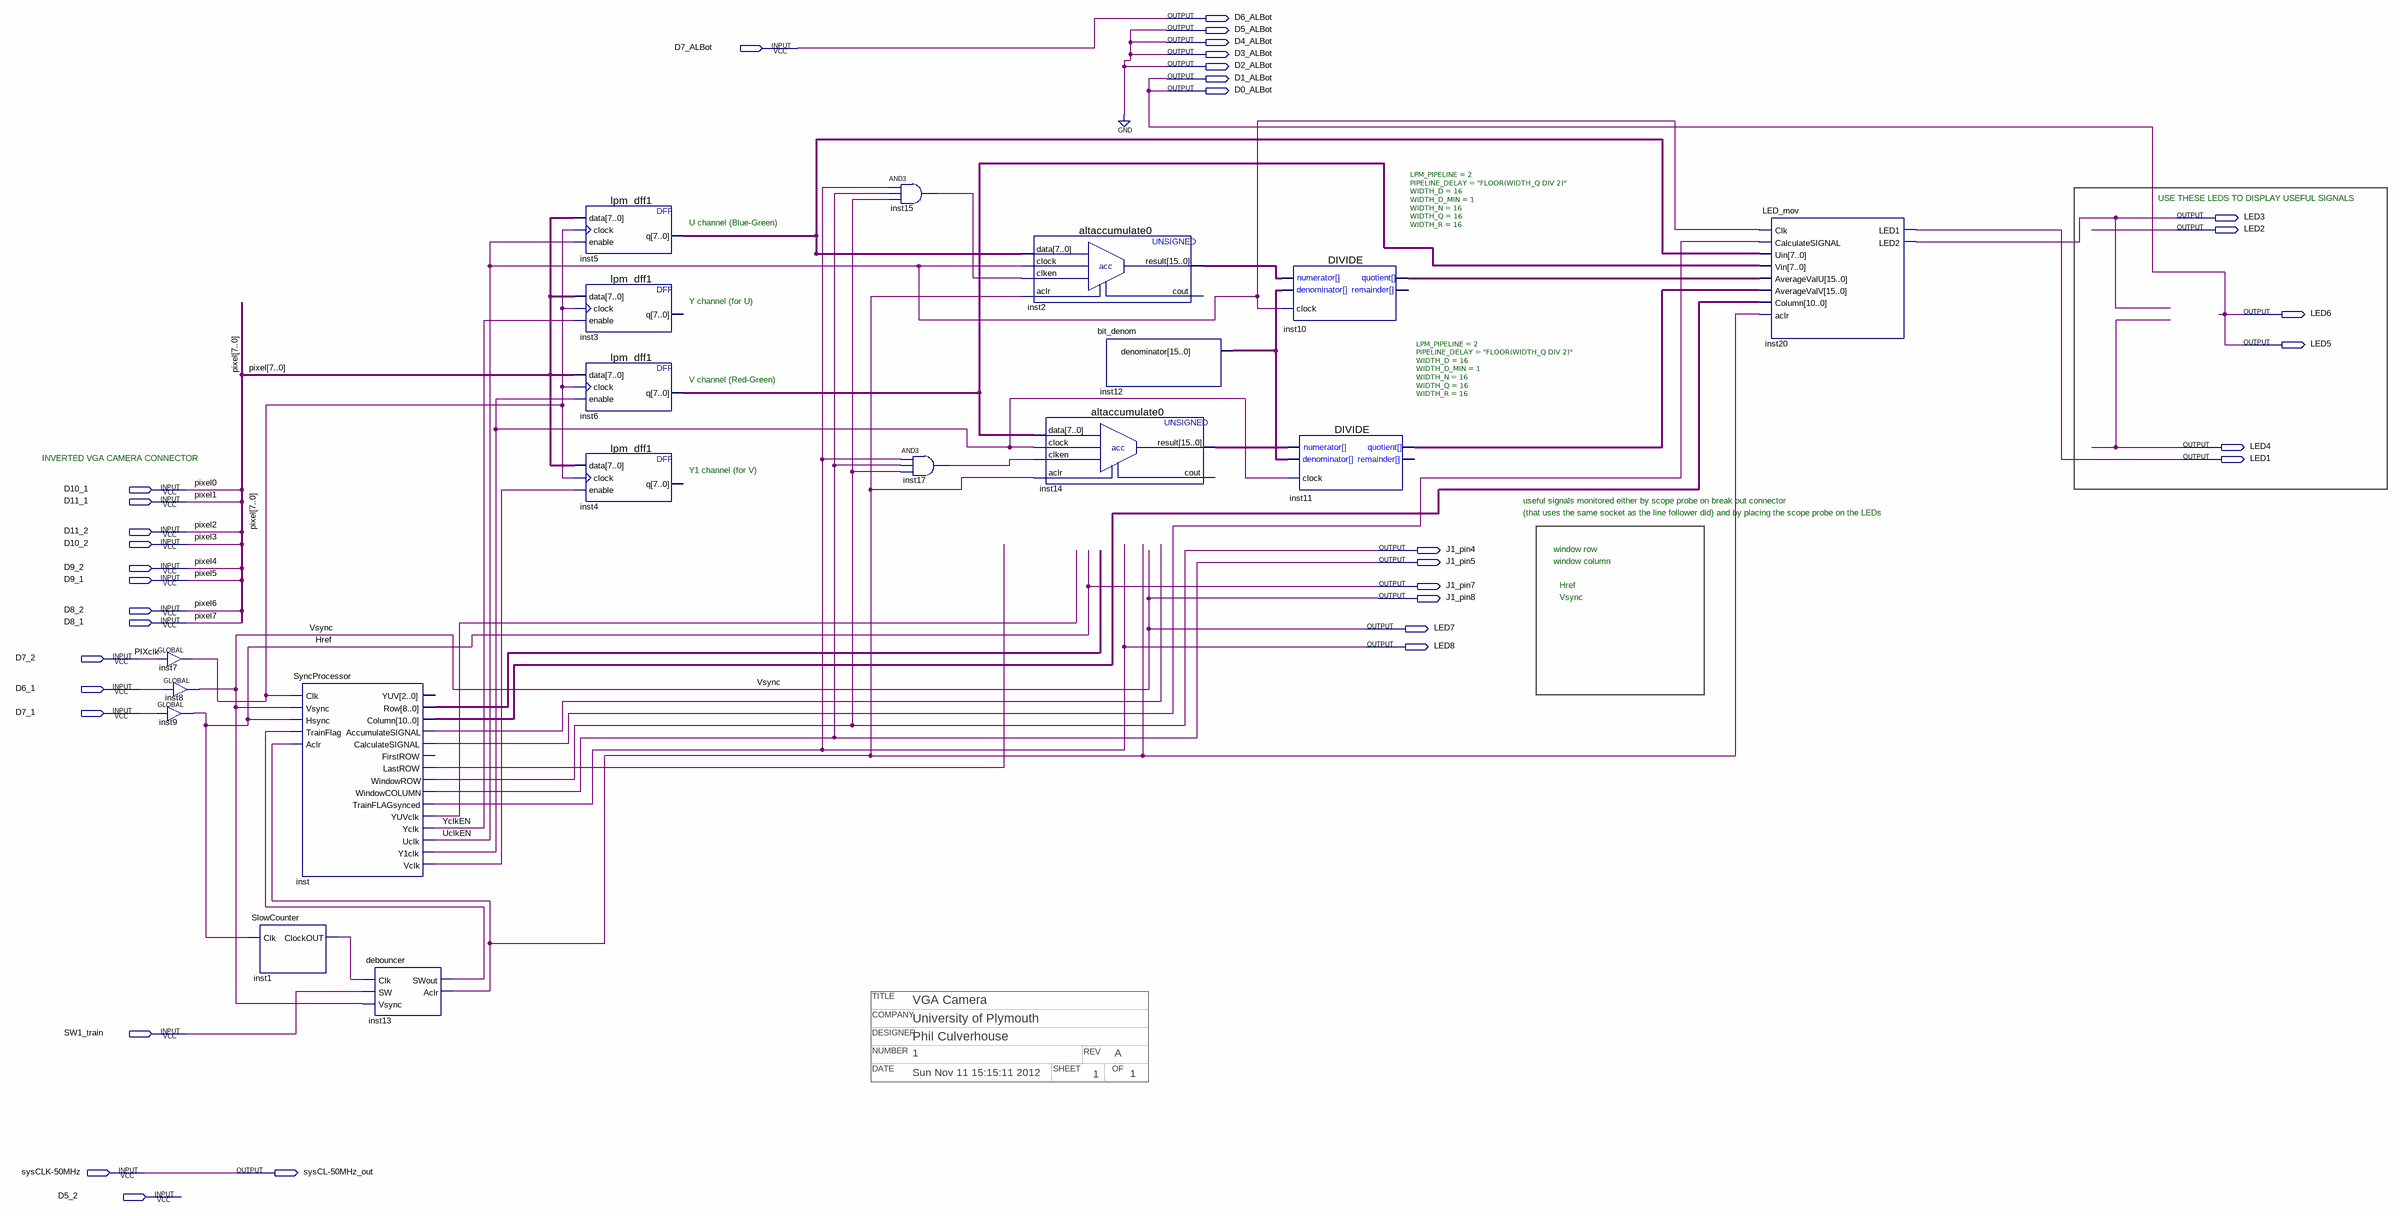
[diagram p0: schematic sheet]
// Quartus schematic VGA-Camera-2006.bdf as structural Verilog: 18 symbols, 35 pins
// Title block: TITLE: VGA Camera; COMPANY: University of Plymouth; DESIGNER: Phil Culverhouse; NUMBER: 1; REV: A; DATE: Sun Nov 11 15:15:11 2012; SHEET: 1; OF: 1
module \VGA-Camera-2006  (
  input  D7_ALBot,
  input  D10_1,
  input  D11_1,
  input  D11_2,
  input  D10_2,
  input  D9_2,
  input  D9_1,
  input  D8_2,
  input  D8_1,
  input  D7_2,
  input  D6_1,
  input  D7_1,
  input  SW1_train,
  input  \sysCLK-50MHz ,
  input  D5_2,
  output D6_ALBot,
  output D5_ALBot,
  output D4_ALBot,
  output D3_ALBot,
  output D2_ALBot,
  output D1_ALBot,
  output D0_ALBot,
  output LED3,
  output LED2,
  output LED6,
  output LED5,
  output LED4,
  output LED1,
  output J1_pin4,
  output J1_pin5,
  output J1_pin7,
  output J1_pin8,
  output LED7,
  output LED8,
  output \sysCL-50MHz_out 
);

  wire inst1_clockout, inst7_out, inst13_aclr, inst13_swout, inst15_out, inst17_out, inst_accumulatesignal,
       inst_calculatesignal, inst_lastrow, inst_vclk, inst_y1clk, inst_yuvclk, UclkEN, YclkEN;
  wire [7:0] inst5_q, inst6_q;
  wire [8:0] inst_row;
  wire [10:0] inst_column;
  wire [15:0] inst2_result, inst10_quotient, inst11_quotient, inst12_denominator, inst14_result;

  GLOBAL inst7 (.IN(D7_2), .OUT(inst7_out));
  GLOBAL inst8 (.IN(D6_1), .OUT(J1_pin8));
  GLOBAL inst9 (.IN(D7_1), .OUT(J1_pin7));
  SlowCounter inst1 (.Clk(J1_pin7), .ClockOUT(inst1_clockout));
  SyncProcessor inst (
    .Clk(inst7_out), .Vsync(J1_pin8), .Hsync(J1_pin7), .TrainFlag(inst13_swout), .Aclr(inst13_aclr),
    .Row(inst_row), .Column(inst_column), .AccumulateSIGNAL(inst_accumulatesignal),
    .CalculateSIGNAL(inst_calculatesignal), .LastROW(inst_lastrow), .WindowROW(J1_pin4),
    .WindowCOLUMN(J1_pin5), .TrainFLAGsynced(LED8), .YUVclk(inst_yuvclk), .Yclk(YclkEN), .Uclk(UclkEN),
    .Y1clk(inst_y1clk), .Vclk(inst_vclk));  // open: YUV, FirstROW
  debouncer inst13 (.Clk(inst1_clockout), .SW(SW1_train), .Vsync(J1_pin8), .SWout(inst13_swout), .Aclr(inst13_aclr));
  lpm_dff1 inst5 (
    .data({D8_1, D8_2, D9_1, D9_2, D10_2, D11_2, D11_1, D10_1}), .clock(inst7_out), .enable(UclkEN),
    .q(inst5_q));
  lpm_dff1 inst3 (
    .data({D8_1, D8_2, D9_1, D9_2, D10_2, D11_2, D11_1, D10_1}), .clock(inst7_out), .enable(YclkEN));  // open: q
  lpm_dff1 inst6 (
    .data({D8_1, D8_2, D9_1, D9_2, D10_2, D11_2, D11_1, D10_1}), .clock(inst7_out), .enable(inst_y1clk),
    .q(inst6_q));
  lpm_dff1 inst4 (
    .data({D8_1, D8_2, D9_1, D9_2, D10_2, D11_2, D11_1, D10_1}), .clock(inst7_out), .enable(inst_vclk));  // open: q
  and inst15 (inst15_out, LED8, J1_pin5, J1_pin4);
  and inst17 (inst17_out, LED8, J1_pin5, J1_pin4);
  altaccumulate0 inst2 (
    .data(inst5_q), .clock(UclkEN), .clken(inst15_out), .aclr(inst13_aclr), .result(inst2_result));  // open: cout
  altaccumulate0 inst14 (
    .data(inst6_q), .clock(inst_y1clk), .clken(inst17_out), .aclr(inst13_aclr), .result(inst14_result));  // open: cout
  bit_denom inst12 (.denominator(inst12_denominator));
  DIVIDE #(.LPM_PIPELINE(2), .PIPELINE_DELAY("FLOOR(WIDTH_Q DIV 2)"), .WIDTH_D(16), .WIDTH_D_MIN(1), .WIDTH_N(16), .WIDTH_Q(16), .WIDTH_R(16)) inst10 (
    .clock(UclkEN), .numerator(inst2_result), .denominator(inst12_denominator), .quotient(inst10_quotient));  // open: remainder
  DIVIDE #(.LPM_PIPELINE(2), .PIPELINE_DELAY("FLOOR(WIDTH_Q DIV 2)"), .WIDTH_D(16), .WIDTH_D_MIN(1), .WIDTH_N(16), .WIDTH_Q(16), .WIDTH_R(16)) inst11 (
    .clock(inst_y1clk), .numerator(inst14_result), .denominator(inst12_denominator),
    .quotient(inst11_quotient));  // open: remainder
  LED_mov inst20 (
    .Clk(UclkEN), .CalculateSIGNAL(inst_calculatesignal), .Uin(inst5_q), .Vin(inst6_q),
    .AverageValU(inst10_quotient), .AverageValV(inst11_quotient), .Column(inst_column), .aclr(inst13_aclr),
    .LED1(LED1), .LED2(LED3));

  assign D1_ALBot = D0_ALBot;
  assign D2_ALBot = 1'b0;
  assign D3_ALBot = 1'b0;
  assign D4_ALBot = 1'b0;
  assign D5_ALBot = 1'b0;
  assign D6_ALBot = D7_ALBot;
  assign LED5 = D0_ALBot;
  assign LED6 = D0_ALBot;
  assign LED7 = J1_pin8;
  assign \sysCL-50MHz_out  = \sysCLK-50MHz ;

  // Other names for the same wires on the sheet: Href = J1_pin7; Vsync = J1_pin8; PIXclk = D7_2;
  //   pixel[7:0] = {D8_1, D8_2, D9_1, D9_2, D10_2, D11_2, D11_1, D10_1}; pixel0 = D10_1; pixel1 = D11_1;
  //   pixel2 = D11_2; pixel3 = D10_2; pixel4 = D9_2; pixel5 = D9_1; pixel6 = D8_2; pixel7 = D8_1

  // Notes on the sheet:
  //   USE THESE LEDS TO DISPLAY USEFUL SIGNALS
  //   U channel (Blue-Green)
  //   Y channel (for U)
  //   V channel (Red-Green)
  //   INVERTED VGA CAMERA CONNECTOR
  //   Y1 channel (for V)
  //   useful signals monitored either by scope probe on break out connector
  //   (that uses the same socket as the line follower did) and by placing the scope probe on the LEDs
  //   window row
  //   window column
  //   Href
  //   Vsync
endmodule
